# Altium project DARKYDEN.PrjPcb (part 1 of 4)
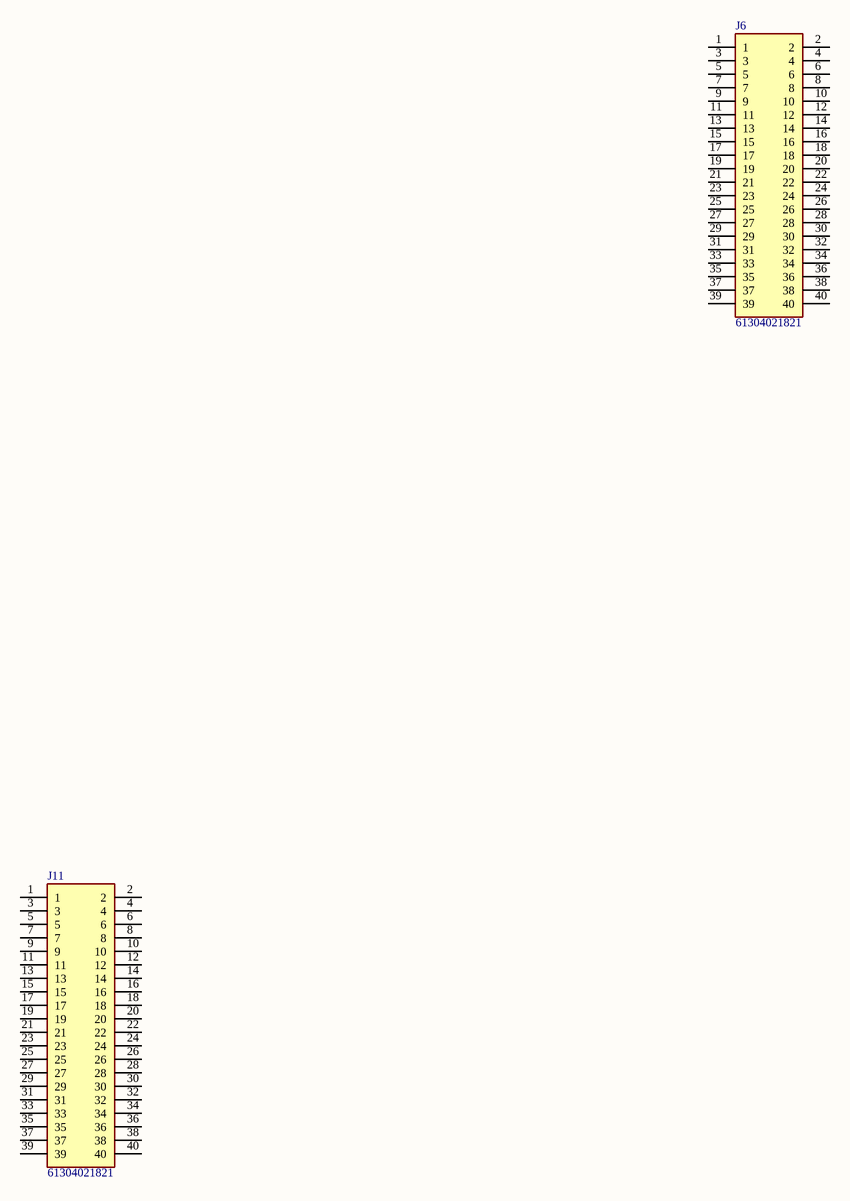
[diagram p0: GPIO.SchDoc]
NomDeProjet: Mon Projet; Revision: Rev.C
8 sheets, 215 parts. Net scope: flat (ports and power ports of the same name join across sheets).
Board file: PCB1.PcbDoc
Sheets:
  GPIO.SchDoc
  HDMI.SchDoc
  NVME.SchDoc
  SDCARD.SchDoc
  CONNECTEUR_2.SchDoc
  eDP.SchDoc
  POWERSYSTEM.SchDoc
  BATTERY_GESTION.SchDoc

## Sheet GPIO.SchDoc: DARKYDEN_GPIO
size Letter; ApprovedBy: APPROUVÉ PAR; Author: Harold Malbrouck; Organization: Cegep Limoilou; Address1: 1300, 8e Avenue; Address2: Québec, QC; Address3: Canada; Address4: G1J 5L5; Revision: Rev.A; SheetNumber: 4; SheetTotal: 22

### Parts
J6  61304021821  [RHDR40W97P254X254_2X20_5130X508X860P]
J11  61304021821  [RHDR40W97P254X254_2X20_5130X508X860P]

### Nets

Not connected (* = marked no-connect by the designer): J6 1 2 3 4 5 6 7 8 9 10 11 12 13 14 15 16 17 18 19 20 21 22 23 24 25 26 27 28 29 30 31 32 33 34 35 36 37 38 39 40; J11 1 2 3 4 5 6 7 8 9 10 11 12 13 14 15 16 17 18 19 20 21 22 23 24 25 26 27 28 29 30 31 32 33 34 35 36 37 38 39 40

### Notes on the sheet
- Titre :
- Conception :
- Date :
- Approbation :
- Heure :
- Révision :
- Feuille
- de
- Fichier :

### Library data of the parts
J6 J11 = 61304021821: Connector; Manufacturer_Name: Wurth Elektronik; Datasheet Link: https://componentsearchengine.com/Datasheets/1/61304021821.pdf; Height: 8.6mm; Manufacturer_Part_Number: 61304021821; Mouser Part Number: 710-61304021821; Mouser Price/Stock: https://www.mouser.co.uk/ProductDetail/Wurth-Elektronik/61304021821?qs=bZr6mbWTK5mzEvTTGhcEyQ%3D%3D

## Sheet HDMI.SchDoc: DARKYDEN_HDMI
size Letter; ApprovedBy: APPROUVÉ PAR; Author: Harold Malbrouck; Organization: Cegep Limoilou; Address1: 1300, 8e Avenue; Address2: Québec, QC; Address3: Canada; Address4: G1J 5L5; Revision: Rev.A; SheetNumber: 5; SheetTotal: 17
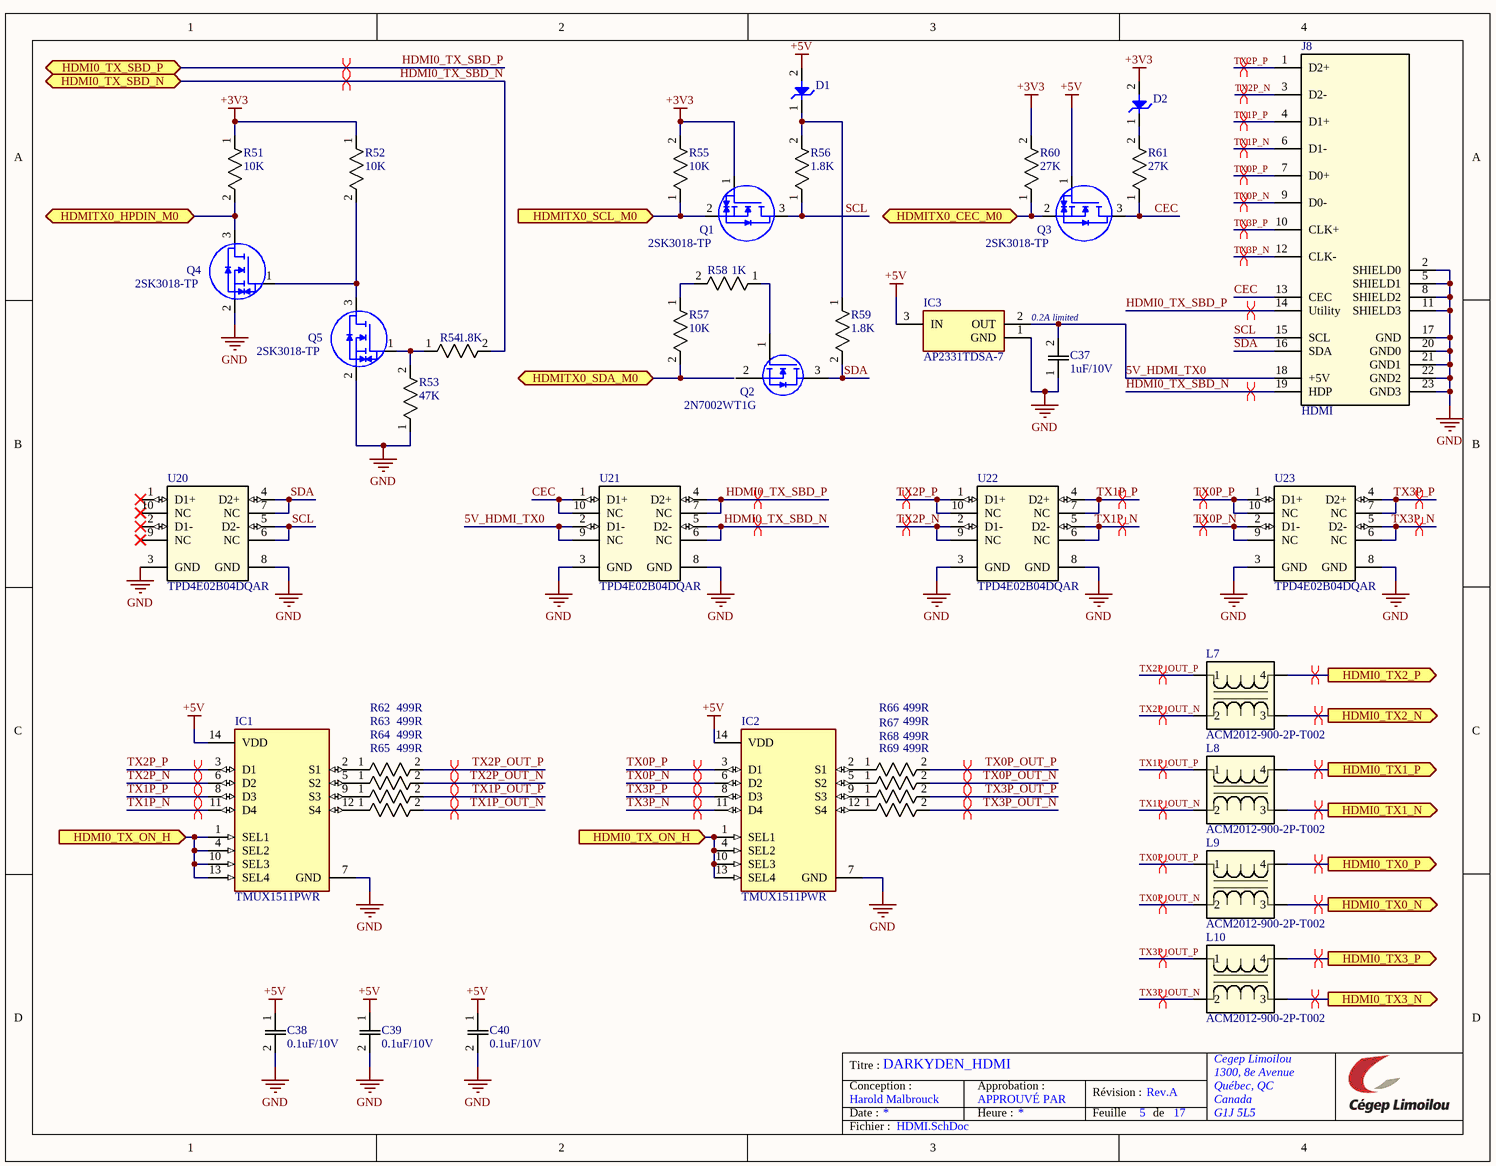
[diagram p1: HDMI.SchDoc]

### Parts
C37  1uF/10V  [CAP_CC0805_YAG]
C38  0.1uF/10V  [CAP_CC0805_YAG]
C39  0.1uF/10V  [CAP_CC0805_YAG]
C40  0.1uF/10V  [CAP_CC0805_YAG]
D1  Schottky  [SODFL1608X70N]  (value not drawn)
D2  Schottky  [SODFL1608X70N]  (value not drawn)
IC1  TMUX1511PWR  [SOP65P640X120-14N]
IC2  TMUX1511PWR  [SOP65P640X120-14N]
IC3  AP2331TDSA-7  [SOT96P240X110-3N]
J8  HDMI  [CONN19_2001-1-2-21-00-BK_CNC]
L7  ACM2012-900-2P-T002  [ACM2012_TDK]
L8  ACM2012-900-2P-T002  [ACM2012_TDK]
L9  ACM2012-900-2P-T002  [ACM2012_TDK]
L10  ACM2012-900-2P-T002  [ACM2012_TDK]
Q1  2SK3018-TP  [SOT65P228X120-3N]
Q2  2N7002WT1G  [SOT-323-3_2P2X1P35_ONS]
Q3  2SK3018-TP  [SOT65P228X120-3N]
Q4  2SK3018-TP  [SOT65P228X120-3N]
Q5  2SK3018-TP  [SOT65P228X120-3N]
R51  10K  [RES_0816_SUS]
R52  10K  [RES_0816_SUS]
R53  47K  [RES_0816_SUS]
R54  1.8K  [RES_0816_SUS]
R55  10K  [RES_0816_SUS]
R56  1.8K  [RES_0816_SUS]
R57  10K  [RES_0816_SUS]
R58  1K  [RES_0816_SUS]
R59  1.8K  [RES_0816_SUS]
R60  27K  [RES_0816_SUS]
R61  27K  [RES_0816_SUS]
R62  499R  [RES_0816_SUS]
R63  499R  [RES_0816_SUS]
R64  499R  [RES_0816_SUS]
R65  499R  [RES_0816_SUS]
R66  499R  [RES_0816_SUS]
R67  499R  [RES_0816_SUS]
R68  499R  [RES_0816_SUS]
R69  499R  [RES_0816_SUS]
U20  TPD4E02B04DQAR  [DQA0010A]
U21  TPD4E02B04DQAR  [DQA0010A]
U22  TPD4E02B04DQAR  [DQA0010A]
U23  TPD4E02B04DQAR  [DQA0010A]

### Ports
HDMI0_TX0_N (out, see CONNECTEUR_4[2B]), HDMI0_TX0_P (out, see CONNECTEUR_4[2B]), HDMI0_TX1_N (out, see CONNECTEUR_4[2B]), HDMI0_TX1_P (out, see CONNECTEUR_4[2B]), HDMI0_TX2_N (out, see CONNECTEUR_4[2B]), HDMI0_TX2_P (out, see CONNECTEUR_4[2B]), HDMI0_TX3_N (out, see CONNECTEUR_4[2B]), HDMI0_TX3_P (out, see CONNECTEUR_4[2B]), HDMI0_TX_ON_H (in, see CONNECTEUR_4[2C], HDMI[1C]), HDMI0_TX_ON_H (in, see CONNECTEUR_4[2C], HDMI[2C]), HDMI0_TX_SBD_N (bidir, see CONNECTEUR_4[2B]), HDMI0_TX_SBD_P (bidir, see CONNECTEUR_4[2B]), HDMITX0_CEC_M0 (bidir, see CONNECTEUR_4[2B]), HDMITX0_HPDIN_M0 (bidir, see CONNECTEUR_3[2C]), HDMITX0_SCL_M0 (in, see CONNECTEUR_4[2B]), HDMITX0_SDA_M0 (bidir, see CONNECTEUR_4[2B])

### Nets
+3V3: D2.2(A) Q1.1(G) R51.1 R52.1 R55.2 R60.2
+5V: C38.1 C39.1 C40.1 D1.2(A) IC1.14(VDD) IC2.14(VDD) IC3.3(IN) Q3.1(G)
GND: C37.1 C38.2 C39.2 C40.2 IC1.7(GND) IC2.7(GND) IC3.1(GND) J8.2(SHIELD0) J8.5(SHIELD1) J8.8(SHIELD2) J8.11(SHIELD3) J8.17(GND) J8.20(GND0) J8.21(GND1) J8.22(GND2) J8.23(GND3) Q4.2(S) Q5.2(S) R53.1 U20.3(GND) U20.8(GND) U21.3(GND) U21.8(GND) U22.3(GND) U22.8(GND) U23.3(GND) U23.8(GND)  [project net PACK-]
5V_HDMI_TX0: C37.2 IC3.2(OUT) J8.18(+5V) U21.2(D1-) U21.9(NC)
CEC: J8.13(CEC) Q3.3(D) R61.1 U21.1(D1+) U21.10(NC)
HDMI0_TX0_N: L9.3 ; port HDMI0_TX0_N
HDMI0_TX0_P: L9.4 ; port HDMI0_TX0_P
HDMI0_TX1_N: L8.3 ; port HDMI0_TX1_N
HDMI0_TX1_P: L8.4 ; port HDMI0_TX1_P
HDMI0_TX2_N: L7.3 ; port HDMI0_TX2_N
HDMI0_TX2_P: L7.4 ; port HDMI0_TX2_P
HDMI0_TX3_N: L10.3 ; port HDMI0_TX3_N
HDMI0_TX3_P: L10.4 ; port HDMI0_TX3_P
HDMI0_TX_ON_H: IC1.1(SEL1) IC1.4(SEL2) IC1.10(SEL3) IC1.13(SEL4) IC2.1(SEL1) IC2.4(SEL2) IC2.10(SEL3) IC2.13(SEL4) ; port HDMI0_TX_ON_H
HDMI0_TX_SBD_N: J8.19(HDP) R54.2 U21.5(D2-) U21.6(NC) ; port HDMI0_TX_SBD_N
HDMI0_TX_SBD_P: J8.14(Utility) U21.4(D2+) U21.7(NC) ; port HDMI0_TX_SBD_P
HDMITX0_CEC_M0: Q3.2(S) R60.1 ; port HDMITX0_CEC_M0
HDMITX0_HPDIN_M0: Q4.3(D) R51.2 ; port HDMITX0_HPDIN_M0
HDMITX0_SCL_M0: Q1.2(S) R55.1 ; port HDMITX0_SCL_M0
HDMITX0_SDA_M0: R57.2 ; port HDMITX0_SDA_M0
SCL: J8.15(SCL) Q1.3(D) R56.1 U20.5(D2-) U20.6(NC)
SDA: J8.16(SDA) Q2.3(DRAIN) R59.2 U20.4(D2+) U20.7(NC)
TX0P_N: IC2.6(D2) J8.9(D0-) U23.2(D1-) U23.9(NC)
TX0P_OUT_N: L9.2 R67.2
TX0P_OUT_P: L9.1 R66.2
TX0P_P: IC2.3(D1) J8.7(D0+) U23.1(D1+) U23.10(NC)
TX1P_N: IC1.11(D4) J8.6(D1-) U22.5(D2-) U22.6(NC)
TX1P_OUT_N: L8.2 R65.2
TX1P_OUT_P: L8.1 R64.2
TX1P_P: IC1.8(D3) J8.4(D1+) U22.4(D2+) U22.7(NC)
TX2P_N: IC1.6(D2) J8.3(D2-) U22.2(D1-) U22.9(NC)
TX2P_OUT_N: L7.2 R63.2
TX2P_OUT_P: L7.1 R62.2
TX2P_P: IC1.3(D1) J8.1(D2+) U22.1(D1+) U22.10(NC)
TX3P_N: IC2.11(D4) J8.12(CLK-) U23.5(D2-) U23.6(NC)
TX3P_OUT_N: L10.2 R69.2
TX3P_OUT_P: L10.1 R68.2
TX3P_P: IC2.8(D3) J8.10(CLK+) U23.4(D2+) U23.7(NC)
NetD1_1: D1.1(K) R56.2 R59.1
NetD2_1: D2.1(K) R61.2
NetIC1_2: IC1.2(S1) R62.1
NetIC1_5: IC1.5(S2) R63.1
NetIC1_9: IC1.9(S3) R64.1
NetIC1_12: IC1.12(S4) R65.1
NetIC2_2: IC2.2(S1) R66.1
NetIC2_5: IC2.5(S2) R67.1
NetIC2_9: IC2.9(S3) R68.1
NetIC2_12: IC2.12(S4) R69.1
NetQ2_1: Q2.1(GATE) R58.1
NetQ4_1: Q4.1(G) Q5.3(D) R52.2
NetQ5_1: Q5.1(G) R53.2 R54.1
NetR57_1: R57.1 R58.2

Not connected (* = marked no-connect by the designer): Q2 2(SOURCE); U20 1(D1+)* 2(D1-)* 9(NC)* 10(NC)*

### Layout directives
differential pair: HDMI0_TX0_N, HDMI0_TX0_P, HDMI0_TX1_N, HDMI0_TX1_P, HDMI0_TX2_N, HDMI0_TX2_P, HDMI0_TX3_N, HDMI0_TX3_P, HDMI0_TX_SBD_N, HDMI0_TX_SBD_P, TX0P_N, TX0P_OUT_N, TX0P_OUT_P, TX0P_P, TX1P_N, TX1P_OUT_N, TX1P_OUT_P, TX1P_P, TX2P_N, TX2P_OUT_N, TX2P_OUT_P, TX2P_P, TX3P_N, TX3P_OUT_N, TX3P_OUT_P, TX3P_P

### Notes on the sheet
- 0.2A limited
- Titre :
- Conception :
- Date :
- Approbation :
- Heure :
- Révision :
- Feuille
- de
- Fichier :

### Library data of the parts
C37-C40 = Capacitor_0805: No Description Available; Mfr_Name: Yageo
D1 D2 = Schottky: DIODE SCHOTTKY 30V 200MA SOD523; Manufacturer_Name: onsemi; Manufacturer_Part_Number: RB520S30T1G; Datasheet Link: https://www.onsemi.com/pub/Collateral/RB520S30T1-D.PDF; Height: 0.7mm; Mouser Part Number: 863-RB520S30T1G; Mouser Price/Stock: https://www.mouser.co.uk/ProductDetail/onsemi/RB520S30T1G?qs=xZq1yRCsb1drMBOPt79ooQ%3D%3D; Arrow Part Number: RB520S30T1G; Arrow Price/Stock: https://www.arrow.com/en/products/rb520s30t1g/on-semiconductor?region=nac
IC1 IC2 = TMUX1511PWR: Integrated Circuit; Manufacturer_Name: Texas Instruments; Datasheet Link: http://www.ti.com/lit/ds/symlink/tmux1511.pdf; Height: 1.2mm; Manufacturer_Part_Number: TMUX1511PWR; Mouser Part Number: 595-TMUX1511PWR; Mouser Price/Stock: https://www.mouser.co.uk/ProductDetail/Texas-Instruments/TMUX1511PWR?qs=qSfuJ%252Bfl%2Fd5zYDGvtvg4tg%3D%3D; Arrow Part Number: TMUX1511PWR; Arrow Price/Stock: https://www.arrow.com/en/products/tmux1511pwr/texas-instruments?utm_currency=USD&region=nac
IC3 = AP2331TDSA-7: Integrated Circuit; Manufacturer_Name: Diodes Incorporated; Datasheet Link: https://www.diodes.com//assets/Datasheets/AP2331TD.pdf; Height: 1.1mm; Manufacturer_Part_Number: AP2331TDSA-7; Mouser Part Number: 621-AP2331TDSA-7; Mouser Price/Stock: https://www.mouser.co.uk/ProductDetail/Diodes-Incorporated/AP2331TDSA-7?qs=W0yvOO0ixfEfFxPGIHJ0Tw%3D%3D; Arrow Part Number: AP2331TDSA-7; Arrow Price/Stock: https://www.arrow.com/en/products/ap2331tdsa-7/diodes-incorporated?region=nac
J8 = HDMI: 2001-1-2-21-00-BK; Mfr_Name: CNC Tech; RefDes: RefDes; Type: Type
L7-L10 = ACM2012-900-2P-T002: No Description Available; Mfr_Name: TDK
Q1 Q3-Q5 = 2SK3018-TP: MOSFET (N-Channel); Manufacturer_Name: MCC; Datasheet Link: https://mccsemi.com/pdf/Products/2SK3018(SOT-323).pdf; Height: 1.2mm; Manufacturer_Part_Number: 2SK3018-TP; Mouser Part Number: 833-2SK3018-TP; Mouser Price/Stock: https://www.mouser.co.uk/ProductDetail/Micro-Commercial-Components-MCC/2SK3018-TP?qs=MoCBKJu1Jj0hqZl4P%2F2qSQ%3D%3D; Arrow Part Number: 2SK3018-TP; Arrow Price/Stock: https://www.arrow.com/en/products/2sk3018-tp/micro-commercial-components?region=europe
Q2 = 2N7002WT1G: No Description Available; Mfr_Name: onsemi; RefDes: RefDes; Type: Type
R51-R69 = RG1608P-104-B-T5: No Description Available; Mfr_Name: Susumu
U20-U23 = TPD4E02B04DQAR: No Description Available; Mfr_Name: Texas Instruments; CompType: IC; TYPE: TYPE; RefDes: RefDes; Application_BuildNumber: *; PartNumber: TPD4E02B04DQAR; PackageReference: DQA0010A; MountType: SMT; RoHS: Y; Manufacturer: Texas Instruments